# EAGLE design Dynamixel (EAGLE 9.6.2)
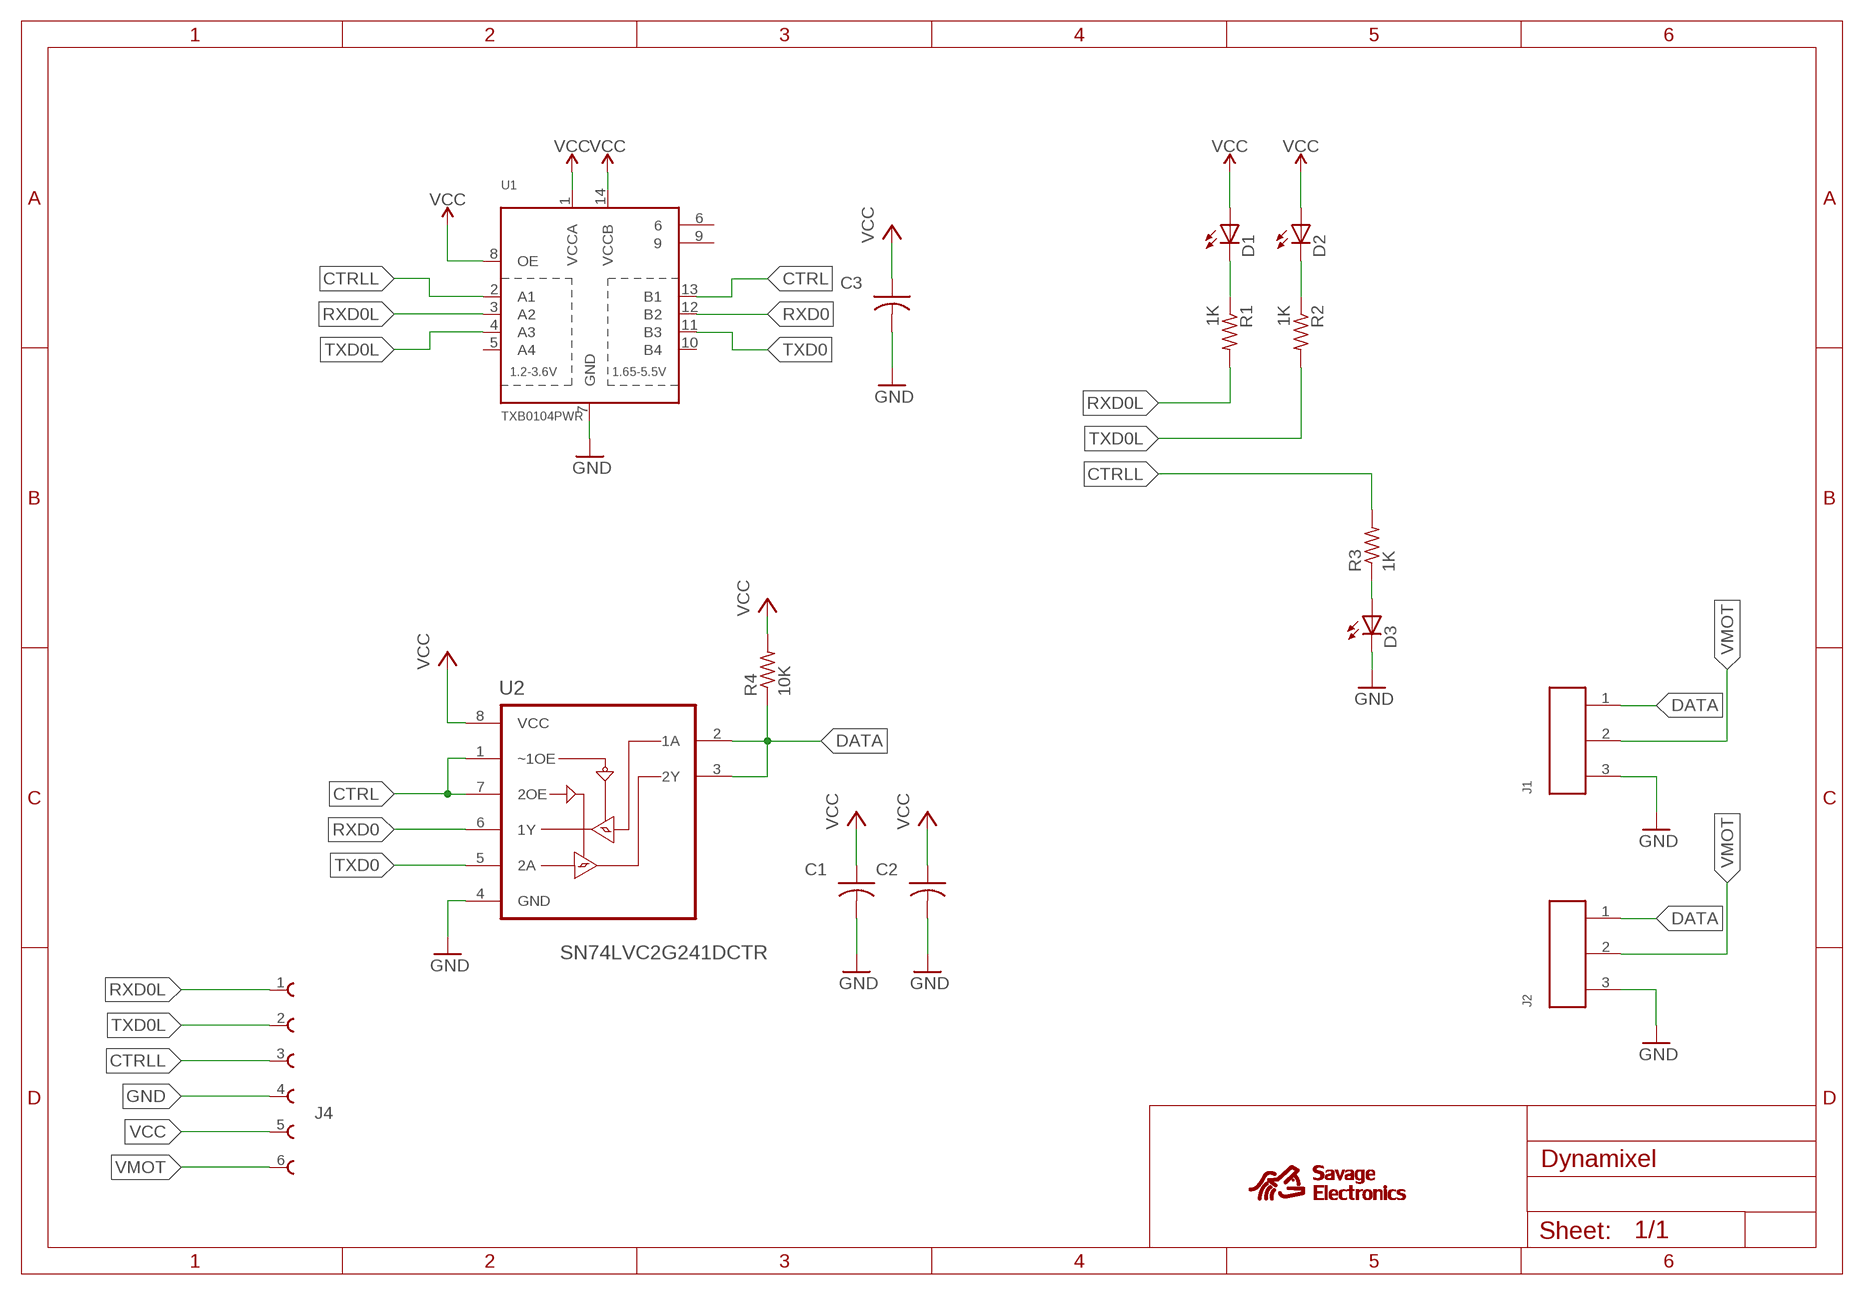
[diagram p0: schematic, sheet 1]

## Parts
C1  1uF  C-USC0805  [C0805]
C2  1uF  C-USC0805  [C0805]
C3  1uF  C-USC0805  [C0805]
D1  LEDCHIP-LED0805  [CHIP-LED0805]
D2  LEDCHIP-LED0805  [CHIP-LED0805]
D3  LEDCHIP-LED0805  [CHIP-LED0805]
J1  62000311722  [62000311722]
J2  64600311622  [64600311622]
J4  61300611121  [61300611121]
R1  1K  R-US_R0805  [R0805]
R2  1K  R-US_R0805  [R0805]
R3  1K  R-US_R0805  [R0805]
R4  10K  R-US_R0805  [R0805]
U1  TXB0104PWR  [TSSOP14]
U2  SN74LVC2G241DCTR  SN74LVC2G241  [SOP65P400X130-8N]
U$2  SE_SMALL_SILK  [SE_SMALL_SILK]
U$3  SE_SMALL_FSILK  [SE_SMALL_FACESILK]

## Nets
CTRL: U1.13(B1) U2.1(~1OE) U2.7(2OE)
CTRLL: J4.3 R3.2 U1.2(A1)
DATA: J1.1 J2.1 R4.1 U2.2(1A) U2.3(2Y)
GND: C1.2 C2.2 C3.2 D3.C J1.3 J2.3 J4.4 U1.7(GND) U2.4(GND)
N$1: D1.C R1.1
N$2: D2.C R2.1
N$3: D3.A R3.1
RXD0: U1.12(B2) U2.6(1Y)
RXD0L: J4.1 R1.2 U1.3(A2)
TXD0: U1.11(B3) U2.5(2A)
TXD0L: J4.2 R2.2 U1.4(A3)
VCC: C1.1 C2.1 C3.1 D1.A D2.A J4.5 R4.2 U1.1(VCCA) U1.8(OE) U1.14(VCCB) U2.8(VCC)
VMOT: J1.2 J2.2 J4.6
Unconnected: U1.5(A4) U1.6 U1.9 U1.10(B4)

## Library data of the parts
C1-C3 = Adafruit:C-US: CAPACITOR, American symbol
D1-D3 = Adafruit:LED: LED OSRAM: - CHIPLED LG R971, LG N971, LY N971, LG Q971, LY Q971, LO R971, LY R971 LH N974, LH R974 LS Q976, LO Q976, LY Q976 LO Q996 - Hyper CHIPLED LW Q18S LB Q993, LB Q99A, LB R99A - SideLED LS A670, LO A670, LY A670, LG A670, LP A670 LB A673, LV A673, LT A673, LW A673 LH A674 LY A675 LS A676, LA A676, LO A676, LY A676, LW A676 LS A679, LY A679, LG A679 - Hyper Micro SIDELED® LS Y876, LA Y876, LO Y876, LY Y876 LT Y87S - SmartLED LW L88C, LW L88S LB L89C, LB L89S, LG L890 LS L89K, LO L89K, LY L89K LS L896, LA L896, LO L896, LY L896 - TOPLED LS T670, LO T670, LY T670, LG T670, LP T670 LSG T670, LSP T670, LSY T670, LOP T670, LYG T670 LG T671, LOG T671, LSG T671 LB T673, LV T673, LT T673, LW T673 LH T674 LS T676, LA T676, LO T676, LY T676, LB T676, LH T676, LSB T676, LW T676 LB T67C, LV T67C, LT T67C, LS T67K, LO T67K, LY T67K, LW E67C LS E67B, LA E67B, LO E67B, LY E67B, LB E67C, LV E67C, LT E67C LW T67C LS T679, LY T679, LG T679 LS T770, LO T770, LY T770, LG T770, LP T770 LB T773, LV T773, LT T773, LW T773 LH T774 LS E675, LA E675, LY E675, LS T675 LS T776, LA T776, LO T776, LY T776, LB T776 LHGB T686 LT T68C, LB T68C - Hyper Mini TOPLED® LB M676 - Mini TOPLED Santana® LG M470 LS M47K, LO M47K, LY M47K Source: http://www.osram.convergy.de/
J1 = Wire-to-Board (rev18a):62000311722: WR-WTB 2.00mm Male Horizontal Shrouded Header, 3 Pins=>Code : Con_WTB_2.00_PCB_THT_62000311722 <http://katalog.we-online.de/media/thumbs2/eican/thb_Con_WTB_2.00_PCB_THT_6200xx11722_pf2.jpg> Details see: http://katalog.we-online.de/en/em/WTB_2_00_MALE_HORIZONTAL_SHROUDED_HEADER_6200XX11722 Created 2014-06-05, Karrer Zheng 2014 (C) Würth Elektronik
J2 = Wire-to-Board (rev18a):64600311622: WR-WTB 2.50mm Male Shrouded Header, 3 Pins=>Code : WR-WTB_Stiftleiste_m.V_64600311622 <http://katalog.we-online.de/media/thumbs2/eican/thb_WR-WTB_Stiftleiste_m.V_64600711622.jpg> Details see: http://katalog.we-online.de/en/em/WTB_2_50_MALE_SHROUDED_HEADER_6460XX11622 Created 2014-06-05, Karrer Zheng 2014 (C) Würth Elektronik
J4 = Eagle_BOARD-TO-BOARD_CONNECTORS (rev18b):61300611121: WR-PHD 2.54mm Pin Header, 6 Pin =>Code : Con_BTB_PHD_2.54_1_THT_61300611121 <http://katalog.we-online.de/media/images/eican/Con_BTB_PHD_2.54_1_THT_6130xx11121_pf2.jpg> Details see: http://katalog.we-online.de/en/em/613_0xx_111_21 Created 2014-05-29, Karrer Zheng 2014 (C) Würth Elektronik
R1-R4 = Adafruit:R-US_: RESISTOR, American symbol
U1 = Adafruit:TXB0104PWR: 4-Bit Bi-Directional Level Shifter 1.2V-3.6V (VCCA) to 1.65V-5.5V (VCCB) bi-directional level shifter with auto direction sensing. Max data rate - VCCA 1.8V: 20Mbps (50ns), VCCA 3.3V: 100Mbps (10ns) Digikey: 296-21929-1-ND
U2 = SN74LVC2G241:SN74LVC2G241; AVAILABILITY: Unavailable; DESCRIPTION: Dual Buffer/Driver With 3-State Outputs; MF: Texas Instruments; MP: SN74LVC2G241; PACKAGE: VFSOP-8 Texas Instruments; PRICE: None
U$2 = SE_NEWLOGO:SE_SMALL_SILK
U$3 = SE_NEWLOGO:SE_SMALL_FSILK

## Board
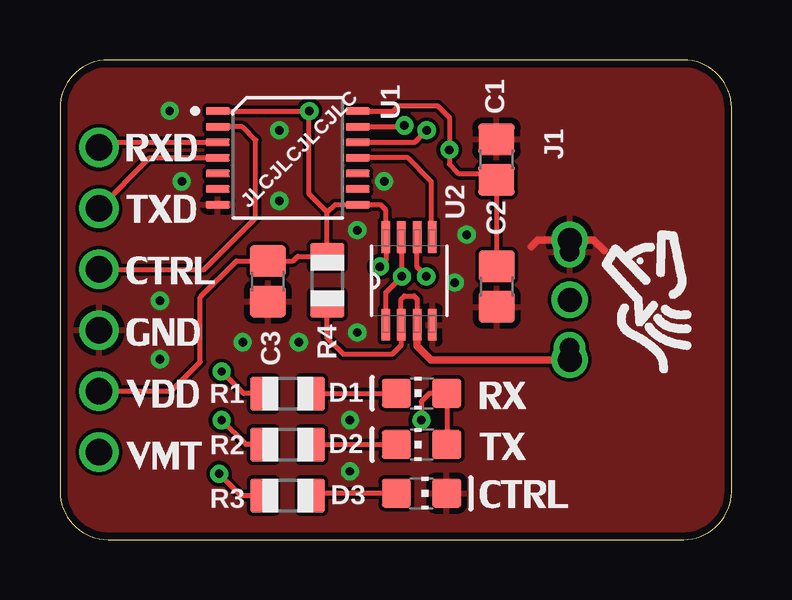
[diagram p1: board, top side]
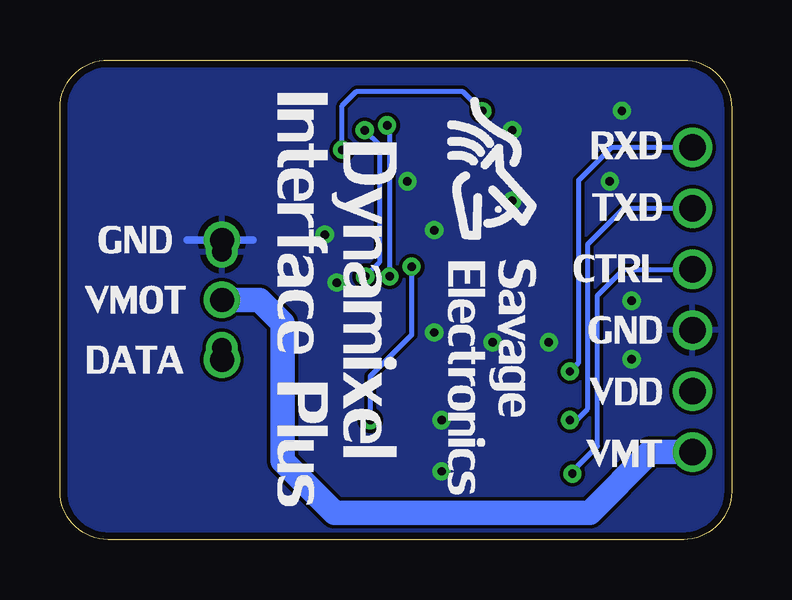
[diagram p2: board, bottom side, seen from below]

Size 28 x 20 mm. Coordinates in mm from the lower left corner, seen from the top.
Outline: 2,0 26,0 arc90 28,2 28,18 arc90 26,20 2,20 arc90 0,18 0,2 arc90 2,0
Copper layers (1*16): Top 0.035mm / dielectric 1.5mm / Bottom 0.035mm
Design rules "default *": minimum track width 6mil, minimum drill 0.35mm, track to track 6mil, track to pad 6mil, pad to pad 6mil, via to via 6mil, smd to smd 6mil, copper to edge 12mil, drill to drill 6mil, minimum pad ring 10mil, minimum via ring 8mil, stop-mask expansion 4mil, vias tented up to drill 15mil, thermal gap 10mil

### Footprints (pad centres in the part's own frame; a part is rotated, then mirrored left to right if it is on the bottom)
C0805 = smd 1.3 x 1.5: 1 -0.85,0; 2 0.85,0
CHIP-LED0805 = smd 1.2 x 1.2: A 0,-1.05; C 0,1.05
62000311722 = drill 0.8: 1 -2,0; 2 0,0; 3 2,0
64600311622 = drill 1: 1 2.5,0; 2 0,0; 3 -2.5,0
61300611121 = drill 1.1: 1 -6.35,0; 2 -3.81,0; 3 -1.27,0; 4 1.27,0; 5 3.81,0; 6 6.35,0
R0805 = smd 1.1 x 1.4: 1 -1,0; 2 1,0
TSSOP14 = smd 0.305 x 0.991: 1 -1.95,-2.918; 2 -1.3,-2.918; 3 -0.65,-2.918; 4 0,-2.918; 5 0.65,-2.918; 6 1.3,-2.918; 7 1.95,-2.918; 8 1.95,2.918; 9 1.3,2.918; 10 0.65,2.918; 11 0,2.918; 12 -0.65,2.918; 13 -1.3,2.918; 14 -1.95,2.918
SOP65P400X130-8N = smd 1.321 x 0.356: 1 -1.829,0.965; 2 -1.829,0.33; 3 -1.829,-0.33; 4 -1.829,-0.965; 5 1.829,-0.965; 6 1.829,-0.33; 7 1.829,0.33; 8 1.829,0.965

### Placement (x,y rotation side)
C1  18.2,15.84 90 top
C2  18.21,10.55 270 top
C3  8.67,10.77 270 top
D1  15.08,6.1 90 top
D2  15.08,3.96 90 top
D3  15.07,1.93 270 top
J1  21.25,10 90 top
J2  21.25,10 270 top
J4  1.63,10 270 top
R1  9.49,6.09 180 top
R2  9.49,3.96 180 top
R3  9.49,1.83 180 top
R4  11.14,10.81 90 top
U1  9.49,15.92 270 top
U2  14.56,10.78 90 top
U$2  10,10 270 bottom
U$3  26.5,6.75 90 top

### Tracks (layer width: path | path; a pad name or v marks a point on that pad's centre or on a via)
CTRL  (via drill 0.35)
  Top 0.203: U1.13 14.3,17.22 v14.36,17.27 | U2.7 14.26,12.58 v14.26,10.97 13.59,10.31 U2.1
  Bottom 0.203: v14.36,17.27 14.26,17.17 v14.26,10.97
CTRLL  (via drill 0.35)
  Top 0.203: R3.2 7.55,1.83 v6.64,2.74 | U1.2 7.61,17.22 8.16,16.66 8.16,13.41 6.02,11.27 J4.3
  Bottom 0.203: J4.3 4.5,11.27 5.59,10.19 5.59,3.89 6.64,2.85 v6.64,2.74
DATA
  Top 0.203: U2.3 14.89,10.04 14.76,10.16 14.36,10.16 14.23,10.03 U2.2 14.23,8.1 13.85,7.72 11.82,7.72 11.14,8.39 R4.1
  Top 0.305: U2.3 14.89,8.07 15.46,7.5 J2.1 J1.1
GND  (via drill 0.35)
  Top 0.305: J1.3 21.25,12.3 21.06,12.5 19.93,12.5 19.65,12.22 | 22.69,12.06 22.25,12.5 J2.3
  Bottom 0.305: J1.3 21.55,12 21.25,12.3 | 21.25,12.3 21.06,12.5 19.95,12.5 | 21.25,12.3 21.44,12.5 22.7,12.5
  other vias: 13.51,14.94 9.14,14.12 9.14,17.07 7.62,8.23 16.46,10.72 12.09,2.84 12.09,4.98 4.17,7.52 4.17,9.96 9.96,8.23 12.4,8.64 12.4,12.9 5.08,14.94 4.57,17.88 16.96,12.72
  pour Top (rank 2): 2,0 26,0 arc90 28,2 28,18 arc90 26,20 2,20 arc90 0,18 0,2 arc90
  pour Bottom (rank 2): 2,0 26,0 arc90 28,2 28,18 arc90 26,20 2,20 arc90 0,18 0,2 arc90
N$1
  Top 0.203: R1.1 10.51,6.1 D1.C
N$2
  Top 0.203: R2.1 D2.C
N$3
  Top 0.203: D3.A 10.6,1.93 R3.1
RXD0  (via drill 0.35)
  Top 0.203: U1.12 14.79,16.57 v15.29,17.07 | v15.27,10.97 14.89,11.36 U2.6
  Bottom 0.203: v15.29,17.07 14.69,16.46 14.69,11.56 v15.27,10.97
RXD0L  (via drill 0.35)
  Top 0.203: J4.1 1.84,16.57 U1.3 | R1.2 7.66,6.09 v6.74,7.01
  Bottom 0.203: J4.1 4.99,16.36 6.38,14.98 6.38,7.37 v6.74,7.01
TXD0
  Top 0.203: U2.5 15.47,12.66 15.47,14.94 14.5,15.92 U1.11
TXD0L  (via drill 0.35)
  Top 0.203: J4.2 3.73,15.92 U1.4 | R2.2 7.75,3.96 v6.74,4.98
  Bottom 0.203: v6.74,4.98 6.47,4.98 5.99,5.45 5.99,12.32 4.5,13.82 J4.2
VCC  (via drill 0.35)
  Top 0.203: J4.5 4.63,6.19 5.85,7.41 5.85,10.11 7.36,11.62 C3.1 9.72,11.62 9.91,11.81 R4.2 11.14,13.65 | 11.14,13.65 11.46,13.97 U1.8 13.36,13.97 13.59,13.73 U2.8 13.59,11.63 v13.34,11.38 | U1.1 v10.39,17.87 10.39,14.4 11.14,13.65 | v15.07,4.98 15.07,5.76 15.41,6.1 D1.A D2.A | C2.1 | C2.1 C1.1 17.95,15.24 16.64,15.24 16.24,15.65 v16.24,16.26 16.24,17.6 15.75,18.09 14.12,18.09 13.9,17.87 U1.14
  Bottom 0.203: v13.34,11.38 13.34,8.53 15.07,6.81 v15.07,4.98 | v16.24,16.26 16.24,18.09 15.63,18.69 11.22,18.69 v10.39,17.87
VMOT
  Bottom 1.016: J4.6 3.38,3.65 5.91,1.12 16.56,1.12 18.72,3.28 18.72,9.03 19.69,10 J1.2

### Text on the board
tPlace: JLCJLCJLCJLC